# Altium schematic sheet 疲劳控制板（新）.SCHDOC
size A4
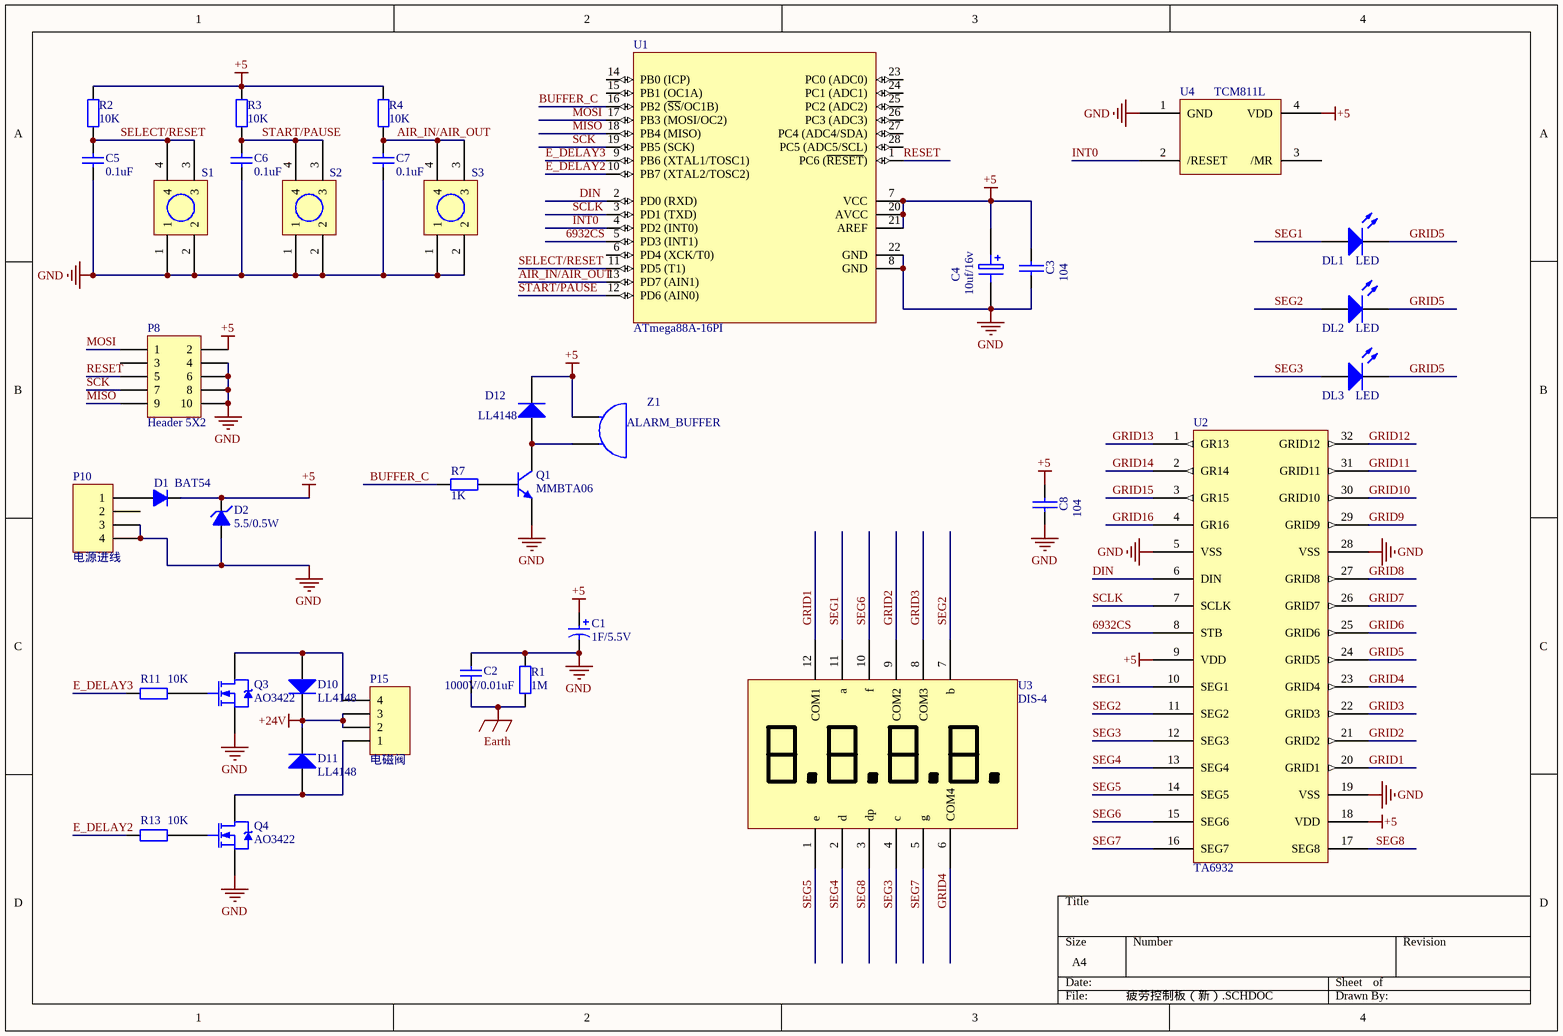
[diagram p0: 疲劳控制板（新）.SCHDOC]

## Parts
C1  1F/5.5V  [法拉电容]
C2  value 1000V/0.01uF  [0805]  (hidden comment: Cap)
C3  104  [0805]
C4  10uf/16v  [贴片极性电容(小)]
C5  value 0.1uF  [0805]  (hidden comment: Cap)
C6  value 0.1uF  [0805]  (hidden comment: Cap)
C7  value 0.1uF  [0805]  (hidden comment: Cap)
C8  104  [0805]
D1  BAT54  [SOT-23]
D2  5.5/0.5W  [MELF-D3516-1406]
D10  LL4148  [MELF-D3516-1406]
D11  LL4148  [MELF-D3516-1406]
D12  LL4148  [MELF-D3516-1406]
DL1  LED  [LED1]
DL2  LED  [LED1]
DL3  LED  [LED1]
P8  Header 5X2  [HDR2X5]
P10  电源进线  [免螺丝接线端子1]
P15  电磁阀  [免螺丝接线端子1]
Q1  MMBTA06  [三极管_SOT23]
Q3  AO3422  [SOT-23]
Q4  AO3422  [SOT-23]
R1  value 1M  [0805]  (hidden comment: Res2)
R2  10K  [0805]
R3  10K  [0805]
R4  10K  [0805]
R7  1K  [0805]
R11  10K  [0805]
R13  10K  [0805]
S1  (no value)  [AN-NIU]
S2  (no value)  [AN-NIU]
S3  (no value)  [AN-NIU]
U1  ATmega88A-16PI  [DIP28(300mil)]
U2  TA6932  [TM6932]
U3  DIS-4  [DIS05_4]
U4  TCM811L  [SOT-143]
Z1  ALARM_BUFFER  [BUFFER]

## Nets
+5: C1.1 C3.1 C4.1 C8.1 D1.3 D2.2 D12.2(K) P8.2 R2.2 R3.2 R4.2 U1.7(VCC) U1.20(AVCC) U1.21(AREF) U2.9(VDD) U2.18(VDD) U4.4(VDD) Z1.1(A)
+24V: D10.2(K) D11.2(K) P15.2 P15.3
Earth: C2.1 R1.1
GND: C1.2 C2.2 C3.2 C4.2 C5.1 C6.1 C7.1 C8.2 D2.1 P8.4 P8.6 P8.8 P8.10 P10.3 P10.4 Q1.E Q3.3(S) Q4.3(S) R1.2 S1.1 S1.2 S2.1 S2.2 S3.1 S3.2 U1.8(GND) U1.22(GND) U2.5(VSS) U2.19(VSS) U2.28(VSS) U4.1(GND)
6932CS: U1.5(PD3_(INT1)) U2.8(STB)
AIR_IN/AIR_OUT: C7.2 R4.1 S3.3 S3.4 U1.13(PD7_(AIN1))
BUFFER_C: R7.2 U1.16(PB2_(~{SS}/OC1B))
DIN: U1.2(PD0_(RXD)) U2.6(DIN)
E_DELAY2: R13.2 U1.10(PB7_(XTAL2/TOSC2))
E_DELAY3: R11.2 U1.9(PB6_(XTAL1/TOSC1))
GRID1: U2.20(GRID1) U3.12(COM1)
GRID2: U2.21(GRID2) U3.9(COM2)
GRID3: U2.22(GRID3) U3.8(COM3)
GRID4: U2.23(GRID4) U3.6(COM4)
GRID5: DL1.2(K) DL2.2(K) DL3.2(K) U2.24(GRID5)
GRID6: U2.25(GRID6)
GRID7: U2.26(GRID7)
GRID8: U2.27(GRID8)
GRID9: U2.29(GRID9)
GRID10: U2.30(GRID10)
GRID11: U2.31(GRID11)
GRID12: U2.32(GRID12)
GRID13: U2.1(GR13)
GRID14: U2.2(GR14)
GRID15: U2.3(GR15)
GRID16: U2.4(GR16)
INT0: U1.4(PD2_(INT0)) U4.2(/RESET)
MISO: P8.9 U1.18(PB4_(MISO))
MOSI: P8.1 U1.17(PB3_(MOSI/OC2))
RESET: P8.5 U1.1(PC6_(~{RESET}))
SCK: P8.7 U1.19(PB5_(SCK))
SCLK: U1.3(PD1_(TXD)) U2.7(SCLK)
SEG1: DL1.1(A) U2.10(SEG1) U3.11(a)
SEG2: DL2.1(A) U2.11(SEG2) U3.7(b)
SEG3: DL3.1(A) U2.12(SEG3) U3.4(c)
SEG4: U2.13(SEG4) U3.2(d)
SEG5: U2.14(SEG5) U3.1(e)
SEG6: U2.15(SEG6) U3.10(f)
SEG7: U2.16(SEG7) U3.5(g)
SEG8: U2.17(SEG8) U3.3(dp)
SELECT/RESET: C5.2 R2.1 S1.3 S1.4 U1.11(PD5_(T1))
START/PAUSE: C6.2 R3.1 S2.3 S2.4 U1.12(PD6_(AIN0))
NetD1_1: D1.1 P10.1
NetD10_1: D10.1(A) P15.4 Q3.2(D)
NetD11_1: D11.1(A) P15.1 Q4.2(D)
NetD12_1: D12.1(A) Q1.C Z1.2(B)
NetQ1_B: Q1.B R7.1
NetQ3_1: Q3.1(G) R11.1
NetQ4_1: Q4.1(G) R13.1

Not connected (* = marked no-connect by the designer): P8 3; P10 2; U1 6(PD4_(XCK/T0)) 14(PB0_(ICP)) 15(PB1_(OC1A)) 23(PC0_(ADC0)) 24(PC1_(ADC1)) 25(PC2_(ADC2)) 26(PC3_(ADC3)) 27(PC4_(ADC4/SDA)) 28(PC5_(ADC5/SCL)); U4 3(/MR)

## Library data of the parts
C1 = 电解电容
C2 C5-C7 = Cap: Capacitor; Published: 8-Jun-2000; LatestRevisionDate: 17-Jul-2002; LatestRevisionNote: Re-released for DXP Platform.; PackageReference: RAD-0.3; Publisher: Altium Limited
C3 C8 = CAP: Capacitor
C4 = ELECTRO1: Electrolytic Capacitor
D1 = 二极管
D2 = 稳压二极管
D10-D12 = Diode: Default Diode; Published: 8-Jun-2000; LatestRevisionDate: 17-Jul-2002; LatestRevisionNote: Re-released for DXP Platform.; PackageDocument: Sep-1996; PackageReference: SMC; Publisher: Altium Limited; Code_JEDEC: DO-214-AB
DL1-DL3 = LED: 发光二极管
P8 = Header 5X2: Header, 5-Pin, Dual row; LatestRevisionDate: 17-Jul-2002; LatestRevisionNote: Re-released for DXP Platform.; Publisher: Altium Limited
P10 P15 = MHDR1X4: Header, 4-Pin; LatestRevisionDate: 17-Jul-2002; LatestRevisionNote: Re-released for DXP Platform.; Publisher: Altium Limited
Q1 = NPN三极管-SOT23
Q3 Q4 = IRF530: N沟道功率MOSFET; Note: Pin 2 is electrically connected to pin 4.; Published: 8-Jun-2000; LatestRevisionDate: 17-Jul-2002; LatestRevisionNote: Re-released for DXP Platform.; DatasheetVersion: PD-9.307O; PackageVersion: Feb-1997; PackageReference: TO-220AB; Publisher: Altium Limited; PackageDescription: TO, Thru-Hole, Vertical, Heatsink Mounted; 3 In-Line Leads; Pitch 2.54 mm; ComponentLink1Description: Manufacturer Link; ComponentLink1URL: http://www.irf.com/; ComponentLink2Description: Datasheet; ComponentLink2URL: http://www.irf.com/product-info/datasheets/data/irf530.pdf
R1 R3 R4 R7 = Res2: Resistor
  R1: Published: 8-Jun-2000; LatestRevisionDate: 17-Jul-2002; LatestRevisionNote: Re-released for DXP Platform.; PackageReference: AXIAL-0.4; Publisher: Altium Limited
R2 R11 R13 = Res2: 贴片电阻
  R11 R13: Published: 8-Jun-2000; LatestRevisionDate: 17-Jul-2002; LatestRevisionNote: Re-released for DXP Platform.; PackageReference: AXIAL-0.4; Publisher: Altium Limited; Value: 10K
S1-S3 = ANJIAN: S?
U1 = ATmega8-16PI: 8-Bit AVR Microcontroller with 8K Bytes of In-System Programmable Flash Memory; Published: 17-Sep-2003; LatestRevisionDate: 04-Mar-2005; LatestRevisionNote: Stylized 3D Model Added.; DatasheetVersion: 2486H-AVR-09/02; PackageVersion: revB, Sep-2001; PackageReference: 28P3; Publisher: Altium Limited; PackageDescription: DIP; 28 Leads; Row Spacing 7.62 mm; Pitch 2.54 mm; ComponentLink1Description: Manufacturer Link; ComponentLink1URL: http://www.atmel.com; ComponentLink2Description: Datasheet; ComponentLink2URL: http://www.atmel.com/dyn/resources/prod_documents/doc2486.pdf
U2 = TM6932
U4 = TCM811
Z1 = BUZZER